# Altium project BTM74-401.PrjPcb
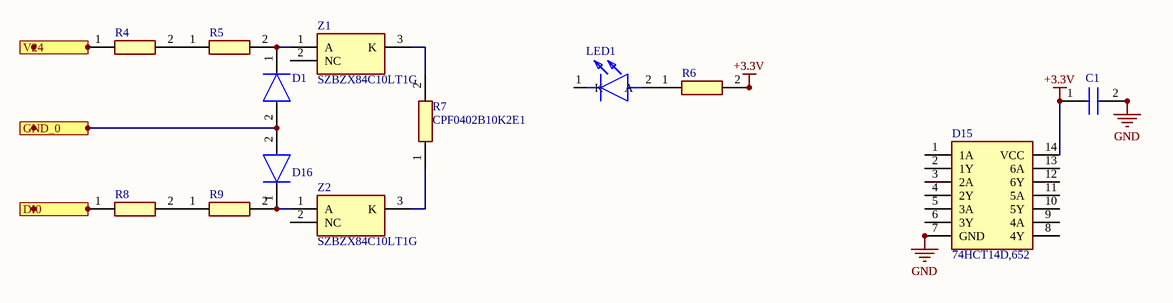
[diagram p0: Sheet1.SchDoc]
2 sheets, 60 parts. Net scope: flat (ports and power ports of the same name join across sheets).
Board file: PCB1.PcbDoc
Sheets:
  Sheet1.SchDoc
  Sheet2.SchDoc

## Sheet Sheet1.SchDoc
size 381 x 241 mm

### Parts
C1  04023C104JAT2A  [CAPC1005X56N]  (value not drawn)
D1  SMF18AT1G  [SODFL3616X98N]  (value not drawn)
D15  74HCT14D,652  [SOIC127P600X175-14N]
D16  SMF18AT1G  [SODFL3616X98N]  (value not drawn)
LED1  151034GS03000  [151034GS03000]  (value not drawn)
R4  CPF0805B330RE  [RESC2012X65N]  (value not drawn)
R5  CPF0805B330RE  [RESC2012X65N]  (value not drawn)
R6  CPF0402B300RE  [RESC1005X35N]  (value not drawn)
R7  CPF0402B10K2E1  [RESC1005X35N]
R8  CPF0805B330RE  [RESC2012X65N]  (value not drawn)
R9  CPF0805B330RE  [RESC2012X65N]  (value not drawn)
Z1  SZBZX84C10LT1G  [SOT96P237X111-3N]
Z2  SZBZX84C10LT1G  [SOT96P237X111-3N]

### Ports
DI0, GND0, GND_0, V24

### Nets
+3.3V: C1.1 D15.14(VCC) R6.2
GND: C1.2 D15.7(GND)
NetD1_1: D1.1(K) R5.2 Z1.1(A)
NetD1_2: D1.2(A) D16.2(A) ; port GND0, port GND_0
NetD16_1: D16.1(K) R9.2 Z2.1(A)
NetLED1_2: LED1.2(A) R6.1
NetR4_1: R4.1 ; port V24
NetR4_2: R4.2 R5.1
NetR7_1: R7.1 Z2.3(K)
NetR7_2: R7.2 Z1.3(K)
NetR8_1: R8.1 ; port DI0
NetR8_2: R8.2 R9.1

Not connected (* = marked no-connect by the designer): D15 1(1A) 2(1Y) 3(2A) 4(2Y) 5(3A) 6(3Y) 8(4Y) 9(4A) 10(5Y) 11(5A) 12(6Y) 13(6A); LED1 1(K); Z1 2(NC); Z2 2(NC)

### Library data of the parts
C1 = 04023C104JAT2A: Capacitor; Manufacturer_Name: AVX; Datasheet Link: http://www.mouser.com/catalog/supplier/library/pdf/AVXSurfaceMountCeramic.pdf; Height: 0.56mm; Manufacturer_Part_Number: 04023C104JAT2A; Mouser Part Number: 581-04023C104JAT2A; Mouser Price/Stock: http://www.mouser.com/Search/ProductDetail.aspx?qs=ZBeOGGPQgEHeKFST9wrKRw%3d%3d; RS Part Number: 1356696; RS Price/Stock: https://uk.rs-online.com/web/p/products/1356696
D1 D16 = SMF18AT1G: Diode; Manufacturer_Name: ON Semiconductor; Allied_Number: 70600054; Datasheet Link: http://www.onsemi.com/pub/Collateral/SMF5.0AT1-D.PDF; Height: 0.98mm; Manufacturer_Part_Number: SMF18AT1G; Allied Price/Stock: http://www.alliedelec.com/on-semiconductor-smf18at1g/70600054/
D15 = 74HCT14D,652: Integrated Circuit; Manufacturer_Name: Nexperia; Datasheet Link: https://assets.nexperia.com/documents/data-sheet/74HC_HCT14.pdf; Height: 1.75mm; Manufacturer_Part_Number: 74HCT14D,652; Mouser Part Number: 771-HCT14D652; Mouser Price/Stock: https://www.mouser.com/Search/Refine.aspx?Keyword=771-HCT14D652; RS Part Number: 1130641P; RS Price/Stock: http://uk.rs-online.com/web/p/products/1130641P
LED1 = 151034GS03000: LED; Manufacturer_Name: Wurth Elektronik; Datasheet Link: http://katalog.we-online.de/led/datasheet/151034GS03000.pdf; Manufacturer_Part_Number: 151034GS03000; RS Part Number: 9010930; RS Price/Stock: https://uk.rs-online.com/web/p/products/9010930
R4 R5 R8 R9 = CPF0805B330RE: Resistor; Manufacturer_Name: TE Connectivity; Allied_Number: 70286839; Datasheet Link: http://docs-europe.electrocomponents.com/webdocs/13d1/0900766b813d116f.pdf; Height: 0.65mm; Manufacturer_Part_Number: CPF0805B330RE; RS Part Number: 6662471; RS Price/Stock: https://uk.rs-online.com/web/p/products/6662471; Allied Price/Stock: https://www.alliedelec.com/te-connectivity-cpf0805b330re/70286839/
R6 = CPF0402B300RE: Resistor; Manufacturer_Name: TE Connectivity; Datasheet Link: http://www.farnell.com/datasheets/1786775.pdf; Height: 0.35mm; Manufacturer_Part_Number: CPF0402B300RE; RS Part Number: 6661327; RS Price/Stock: https://uk.rs-online.com/web/p/products/6661327
R7 = CPF0402B10K2E1: Resistor; Manufacturer_Name: TE Connectivity; Allied_Number: 70286155; Datasheet Link: http://www.farnell.com/datasheets/1786775.pdf; Height: 0.35mm; Manufacturer_Part_Number: CPF0402B10K2E1; Mouser Part Number: 279-CPF0402B10K2E1; Mouser Price/Stock: https://www.mouser.com/Search/Refine.aspx?Keyword=279-CPF0402B10K2E1; RS Part Number: 7015028; RS Price/Stock: https://uk.rs-online.com/web/p/products/7015028; Allied Price/Stock: https://www.alliedelec.com/te-connectivity-cpf0402b10k2e1/70286155/
Z1 Z2 = SZBZX84C10LT1G: Zener Diode; Manufacturer_Name: ON Semiconductor; Allied_Number: 70467681; Datasheet Link: http://www.onsemi.com/pub/Collateral/BZX84C2V4LT1-D.PDF; Height: 1.11mm; Manufacturer_Part_Number: SZBZX84C10LT1G; Mouser Part Number: 863-SZBZX84C10LT1G; Mouser Price/Stock: https://www.mouser.com/Search/Refine.aspx?Keyword=863-SZBZX84C10LT1G; RS Part Number: 8052914; RS Price/Stock: http://uk.rs-online.com/web/p/products/8052914; Allied Price/Stock: http://www.alliedelec.com/on-semiconductor-szbzx84c10lt1g/70467681/

## Sheet Sheet2.SchDoc
size A4
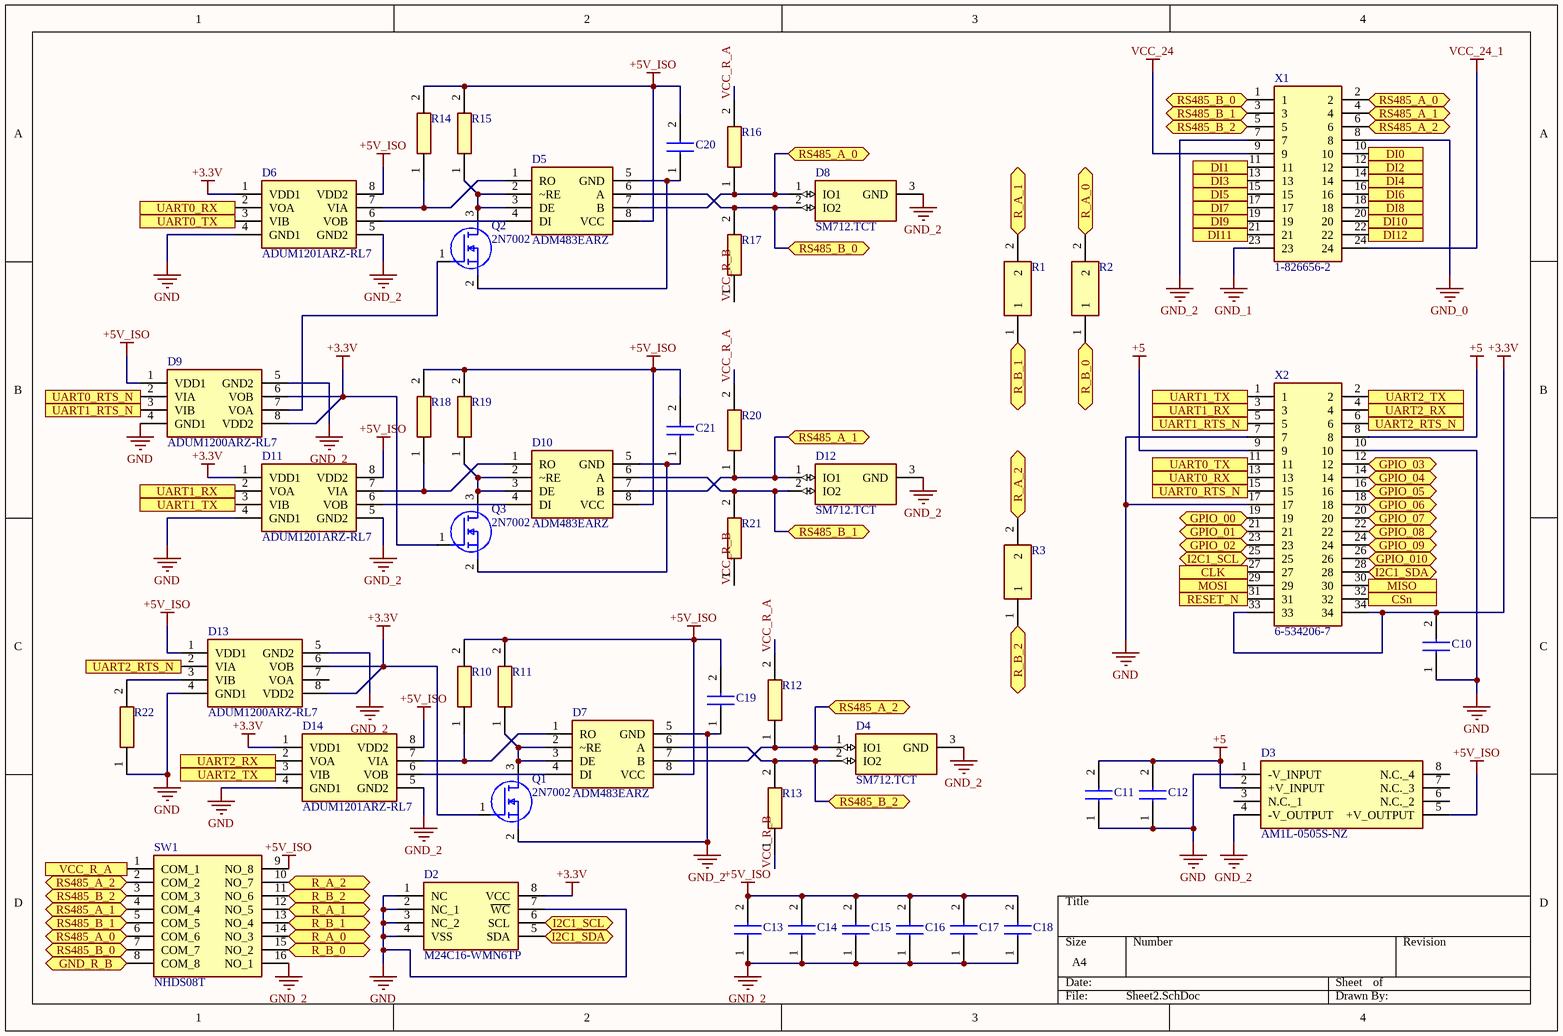
[diagram p1: Sheet2.SchDoc]

### Parts
C10  04024D106MAT2A  [CAPC1005X56N]  (value not drawn)
C11  04023C104JAT2A  [CAPC1005X56N]  (value not drawn)
C12  04024D106MAT2A  [CAPC1005X56N]  (value not drawn)
C13  04023C104JAT2A  [CAPC1005X56N]  (value not drawn)
C14  04023C104JAT2A  [CAPC1005X56N]  (value not drawn)
C15  04023C104JAT2A  [CAPC1005X56N]  (value not drawn)
C16  04023C104JAT2A  [CAPC1005X56N]  (value not drawn)
C17  04024D106MAT2A  [CAPC1005X56N]  (value not drawn)
C18  04024D106MAT2A  [CAPC1005X56N]  (value not drawn)
C19  04023C104JAT2A  [CAPC1005X56N]  (value not drawn)
C20  04023C104JAT2A  [CAPC1005X56N]  (value not drawn)
C21  04023C104JAT2A  [CAPC1005X56N]  (value not drawn)
D2  M24C16-WMN6TP  [SOIC127P600X175-8N]
D3  AM1L-0505S-NZ  [SOP254P1120X650-8N]
D4  SM712.TCT  [SOT95P237X112-3N]
D5  ADM483EARZ  [SOIC127P600X175-8N]
D6  ADUM1201ARZ-RL7  [SOIC127P600X175-8N]
D7  ADM483EARZ  [SOIC127P600X175-8N]
D8  SM712.TCT  [SOT95P237X112-3N]
D9  ADUM1200ARZ-RL7  [SOIC127P600X175-8N]
D10  ADM483EARZ  [SOIC127P600X175-8N]
D11  ADUM1201ARZ-RL7  [SOIC127P600X175-8N]
D12  SM712.TCT  [SOT95P237X112-3N]
D13  ADUM1200ARZ-RL7  [SOIC127P600X175-8N]
D14  ADUM1201ARZ-RL7  [SOIC127P600X175-8N]
Q1  2N7002  [SOT95P240X120-3N]
Q2  2N7002  [SOT95P240X120-3N]
Q3  2N7002  [SOT95P240X120-3N]
R1  BLM18AG121SN1D  [BEADC1608X95N]  (value not drawn)
R2  BLM18AG121SN1D  [BEADC1608X95N]  (value not drawn)
R3  BLM18AG121SN1D  [BEADC1608X95N]  (value not drawn)
R10  CPF0402B14K7E1  [RESC1005X35N]  (value not drawn)
R11  CPF0402B14K7E1  [RESC1005X35N]  (value not drawn)
R12  CPF0402B475RE1  [RESC1005X35N]  (value not drawn)
R13  CPF0402B475RE1  [RESC1005X35N]  (value not drawn)
R14  CPF0402B14K7E1  [RESC1005X35N]  (value not drawn)
R15  CPF0402B14K7E1  [RESC1005X35N]  (value not drawn)
R16  CPF0402B475RE1  [RESC1005X35N]  (value not drawn)
R17  CPF0402B475RE1  [RESC1005X35N]  (value not drawn)
R18  CPF0402B14K7E1  [RESC1005X35N]  (value not drawn)
R19  CPF0402B14K7E1  [RESC1005X35N]  (value not drawn)
R20  CPF0402B475RE1  [RESC1005X35N]  (value not drawn)
R21  CPF0402B475RE1  [RESC1005X35N]  (value not drawn)
R22  CPF0402B14K7E1  [RESC1005X35N]  (value not drawn)
SW1  NHDS08T  [NHDS08T]
X1  1-826656-2  [HDRV24W85P254_2X12_3048X500X900P]
X2  6-534206-7  [SHDR34W76P254_2X17_4318X503X813P]

### Ports
CLK (out), CSn (out), DI0 (in), DI1 (in), DI2 (in), DI3 (in), DI4 (in), DI5 (in), DI6 (in), DI7 (in), DI8 (in), DI9 (in), DI10 (in), DI11 (in), DI12 (in), GND_R_B (bidir), GPIO_00 (bidir), GPIO_01 (bidir), GPIO_02 (bidir), GPIO_03 (bidir), GPIO_04 (bidir), GPIO_05 (bidir), GPIO_06 (bidir), GPIO_07 (bidir), GPIO_08 (bidir), GPIO_09 (bidir), GPIO_010 (bidir), I2C1_SCL (bidir), I2C1_SDA (bidir), MISO (in), MOSI (out), R_A_0 (bidir), R_A_1 (bidir), R_A_2 (bidir), R_B_0 (bidir), R_B_1 (bidir), R_B_2 (bidir), RESET_N (in), RS485_A_0 (bidir), RS485_A_1 (bidir), RS485_A_2 (bidir), RS485_B_0 (bidir), RS485_B_1 (bidir), RS485_B_2 (bidir), UART0_RTS_N (out), UART0_RX (in), UART0_TX (out), UART1_RTS_N (out), UART1_RX (in), UART1_TX (out), UART2_RTS_N (out), UART2_RX (in), UART2_TX (out), VCC_R_A

### Nets
+3.3V: C10.2 D2.8(VCC) D6.1(VDD1) D9.6(VOB) D9.8(VDD2) D11.1(VDD1) D13.6(VOB) D13.8(VDD2) D14.1(VDD1) Q1.1(G) Q3.1(G) X2.33 X2.34
+5: C11.2 C12.2 D3.2(+V_INPUT) X2.8 X2.9
+5V_ISO: C13.2 C14.2 C15.2 C16.2 C17.2 C18.2 C19.2 C20.2 C21.2 D3.5(+V_OUTPUT) D5.8(VCC) D6.8(VDD2) D7.8(VCC) D9.1(VDD1) D10.8(VCC) D11.8(VDD2) D13.1(VDD1) D14.8(VDD2) R10.2 R11.2 R14.2 R15.2 R18.2 R19.2 SW1.9(NO_8)
GND: C10.1 C11.1 C12.1 D2.1(NC) D2.2(NC_1) D2.3(NC_2) D2.4(VSS) D2.7(~{WC}) D3.1(-V_INPUT) D6.4(GND1) D9.4(GND1) D11.4(GND1) D13.4(GND1) D14.4(GND1) R22.1 X2.7 X2.10 X2.17
GND_0: X1.8
GND_1: X1.23
GND_2: C13.1 C14.1 C15.1 C16.1 C17.1 C18.1 C19.1 D3.4(-V_OUTPUT) D4.3(GND) D6.5(GND2) D7.5(GND) D8.3(GND) D9.5(GND2) D11.5(GND2) D12.3(GND) D13.5(GND2) D14.5(GND2) Q1.2(S) SW1.16(NO_1) X1.7
VCC_24: X1.9
VCC_24_1: X1.24
VCC_R_A: R12.2 R16.2 R20.2
VCC_R_B: R13.1 R17.1 R21.1
NetC20_1: C20.1 D5.5(GND) Q2.2(S)
NetC21_1: C21.1 D10.5(GND) Q3.2(S)
NetD2_5: D2.5(SDA) X2.28 ; port I2C1_SDA
NetD2_6: D2.6(SCL) X2.25 ; port I2C1_SCL
NetD4_1: D4.1(IO1) D7.7(B) R12.1 SW1.2(COM_2) X1.6 ; port RS485_A_2
NetD4_2: D4.2(IO2) D7.6(A) R13.2 SW1.3(COM_3) X1.5 ; port RS485_B_2
NetD5_1: D5.1(RO) D6.7(VIA) R14.1
NetD5_2: D5.2(~RE) D5.3(DE) Q2.3(D) R15.1
NetD5_4: D5.4(DI) D6.6(VOB)
NetD5_6: D5.6(A) D8.2(IO2) R17.2 SW1.7(COM_7) X1.1 ; port RS485_B_0
NetD5_7: D5.7(B) D8.1(IO1) R16.1 SW1.6(COM_6) X1.2 ; port RS485_A_0
NetD6_2: D6.2(VOA) X2.13 ; port UART0_RX
NetD6_3: D6.3(VIB) X2.11 ; port UART0_TX
NetD7_1: D7.1(RO) D14.7(VIA) R10.1
NetD7_2: D7.2(~RE) D7.3(DE) Q1.3(D) R11.1
NetD7_4: D7.4(DI) D14.6(VOB)
NetD9_2: D9.2(VIA) X2.15 ; port UART0_RTS_N
NetD9_3: D9.3(VIB) X2.5 ; port UART1_RTS_N
NetD9_7: D9.7(VOA) Q2.1(G)
NetD10_1: D10.1(RO) D11.7(VIA) R18.1
NetD10_2: D10.2(~RE) D10.3(DE) Q3.3(D) R19.1
NetD10_4: D10.4(DI) D11.6(VOB)
NetD10_6: D10.6(A) D12.2(IO2) R21.2 SW1.5(COM_5) X1.3 ; port RS485_B_1
NetD10_7: D10.7(B) D12.1(IO1) R20.1 SW1.4(COM_4) X1.4 ; port RS485_A_1
NetD11_2: D11.2(VOA) X2.3 ; port UART1_RX
NetD11_3: D11.3(VIB) X2.1 ; port UART1_TX
NetD13_2: D13.2(VIA) X2.6 ; port UART2_RTS_N
NetD13_3: D13.3(VIB) R22.2
NetD14_2: D14.2(VOA) X2.4 ; port UART2_RX
NetD14_3: D14.3(VIB) X2.2 ; port UART2_TX
NetR1_1: R1.1 SW1.13(NO_4) ; port R_B_1
NetR1_2: R1.2 SW1.12(NO_5) ; port R_A_1
NetR2_1: R2.1 SW1.15(NO_2) ; port R_B_0
NetR2_2: R2.2 SW1.14(NO_3) ; port R_A_0
NetR3_1: R3.1 SW1.11(NO_6) ; port R_B_2
NetR3_2: R3.2 SW1.10(NO_7) ; port R_A_2
NetR8_1: X1.10 ; port DI0
NetSW1_1: SW1.1(COM_1) ; port VCC_R_A
NetSW1_8: SW1.8(COM_8) ; port GND_R_B
NetX1_11: X1.11 ; port DI1
NetX1_12: X1.12 ; port DI2
NetX1_13: X1.13 ; port DI3
NetX1_14: X1.14 ; port DI4
NetX1_15: X1.15 ; port DI5
NetX1_16: X1.16 ; port DI6
NetX1_17: X1.17 ; port DI7
NetX1_18: X1.18 ; port DI8
NetX1_19: X1.19 ; port DI9
NetX1_20: X1.20 ; port DI10
NetX1_21: X1.21 ; port DI11
NetX1_22: X1.22 ; port DI12
NetX2_12: X2.12 ; port GPIO_03
NetX2_14: X2.14 ; port GPIO_04
NetX2_16: X2.16 ; port GPIO_05
NetX2_18: X2.18 ; port GPIO_06
NetX2_19: X2.19 ; port GPIO_00
NetX2_20: X2.20 ; port GPIO_07
NetX2_21: X2.21 ; port GPIO_01
NetX2_22: X2.22 ; port GPIO_08
NetX2_23: X2.23 ; port GPIO_02
NetX2_24: X2.24 ; port GPIO_09
NetX2_26: X2.26 ; port GPIO_010
NetX2_27: X2.27 ; port CLK
NetX2_29: X2.29 ; port MOSI
NetX2_30: X2.30 ; port MISO
NetX2_31: X2.31 ; port RESET_N
NetX2_32: X2.32 ; port CSn

Not connected (* = marked no-connect by the designer): D3 3(N.C._1) 6(N.C._2) 7(N.C._3) 8(N.C._4); D13 7(VOA)

### Library data of the parts
C10 C12 C17 C18 = 04024D106MAT2A: Capacitor; Manufacturer_Name: AVX; Datasheet Link: http://www.mouser.com/catalog/supplier/library/pdf/AVXSurfaceMountCeramic.pdf; Height: 0.56mm; Manufacturer_Part_Number: 04024D106MAT2A; Mouser Part Number: 581-04024D106MAT2A; Mouser Price/Stock: https://www.mouser.com/Search/Refine.aspx?Keyword=581-04024D106MAT2A
C11 C13-C16 C19-C21 = 04023C104JAT2A: Capacitor; Manufacturer_Name: AVX; Datasheet Link: http://www.mouser.com/catalog/supplier/library/pdf/AVXSurfaceMountCeramic.pdf; Height: 0.56mm; Manufacturer_Part_Number: 04023C104JAT2A; Mouser Part Number: 581-04023C104JAT2A; Mouser Price/Stock: http://www.mouser.com/Search/ProductDetail.aspx?qs=ZBeOGGPQgEHeKFST9wrKRw%3d%3d; RS Part Number: 1356696; RS Price/Stock: https://uk.rs-online.com/web/p/products/1356696
D2 = M24C16-WMN6TP: Integrated Circuit; Manufacturer_Name: STMicroelectronics; Allied_Number: 70013715; Datasheet Link: http://www.st.com/st-web-ui/static/active/en/resource/technical/document/datasheet/DM00061111.pdf; Height: 1.75mm; Manufacturer_Part_Number: M24C16-WMN6TP; Mouser Part Number: 511-M24C16-WMN6TP; Mouser Price/Stock: https://www.mouser.com/Search/Refine.aspx?Keyword=511-M24C16-WMN6TP; RS Part Number: 6862390; RS Price/Stock: https://uk.rs-online.com/web/p/products/6862390; Allied Price/Stock: http://www.alliedelec.com/stmicroelectronics-m24c16-wmn6tp/70013715/
D3 = AM1L-0505S-NZ: Power Supply; Manufacturer_Name: aimtec; Datasheet Link: http://www.aimtec.com/site/Aimtec/files/Datasheet/HighResolution/AM1L-N-Z.pdf; Height: 6.5mm; Manufacturer_Part_Number: AM1L-0505S-NZ
D4 D8 D12 = SM712.TCT: Diode; Manufacturer_Name: SEMTECH; Datasheet Link: http://docs-emea.rs-online.com/webdocs/1385/0900766b81385d5f.pdf; Height: 1.12mm; Manufacturer_Part_Number: SM712.TCT; Mouser Part Number: 947-SM712.TCT; Mouser Price/Stock: https://www.mouser.com/Search/Refine.aspx?Keyword=947-SM712.TCT; RS Part Number: 6783470P; RS Price/Stock: http://uk.rs-online.com/web/p/products/6783470P
D5 D7 D10 = ADM483EARZ: Integrated Circuit; Manufacturer_Name: Analog Devices; Manufacturer_Part_Number: ADM483EARZ; Mouser Part Number: 584-ADM483EARZ; Mouser Price/Stock: https://www.mouser.com/Search/Refine.aspx?Keyword=584-ADM483EARZ; RS Part Number: 2509605926; RS Price/Stock: http://uk.rs-online.com/web/p/products/2509605926
D6 D11 D14 = ADUM1201ARZ-RL7: Integrated Circuit; Manufacturer_Name: Analog Devices; Datasheet Link: http://www.analog.com/media/en/technical-documentation/data-sheets/ADuM1200_1201.pdf; Height: 1.75mm; Manufacturer_Part_Number: ADUM1201ARZ-RL7; Mouser Part Number: 584-ADUM1201ARZ-R7; Mouser Price/Stock: https://www.mouser.com/Search/Refine.aspx?Keyword=584-ADUM1201ARZ-R7; RS Part Number: 1832299; RS Price/Stock: http://uk.rs-online.com/web/p/products/1832299
D9 D13 = ADUM1200ARZ-RL7: Integrated Circuit; Manufacturer_Name: Analog Devices; Datasheet Link: http://componentsearchengine.com/Datasheets/1/ADUM1200ARZ-RL7.pdf; Manufacturer_Part_Number: ADUM1200ARZ-RL7; Mouser Part Number: 584-ADUM1200ARZ-R7; Mouser Price/Stock: https://www.mouser.com/Search/Refine.aspx?Keyword=584-ADUM1200ARZ-R7; RS Part Number: 9140444; RS Price/Stock: http://uk.rs-online.com/web/p/products/9140444
Q1-Q3 = 2N7002: MOSFET (N-Channel); Manufacturer_Name: Fairchild Semiconductor; Datasheet Link: http://www.onsemi.com/pub/Collateral/NDS7002A-D.PDF; Height: 1.2mm; Manufacturer_Part_Number: 2N7002; Mouser Part Number: 512-2N7002; Mouser Price/Stock: https://www.mouser.com/Search/Refine.aspx?Keyword=512-2N7002
R1-R3 = BLM18AG121SN1D: Ferrite Bead; Manufacturer_Name: Murata Electronics; Datasheet Link: http://www.murata.com/~/media/webrenewal/support/library/catalog/products/emc/emifil/c31e.ashx?la=en-gb; Height: 0.95mm; Manufacturer_Part_Number: BLM18AG121SN1D; Mouser Part Number: 81-BLM11A121S; Mouser Price/Stock: https://www.mouser.com/Search/Refine.aspx?Keyword=81-BLM11A121S; RS Part Number: 6291628; RS Price/Stock: http://uk.rs-online.com/web/p/products/6291628
R10 R11 R14 R15 R18 R19 R22 = CPF0402B14K7E1: Resistor; Manufacturer_Name: TE Connectivity; Allied_Number: 70286210; Datasheet Link: http://www.farnell.com/datasheets/1786775.pdf; Height: 0.35mm; Manufacturer_Part_Number: CPF0402B14K7E1; Mouser Part Number: 279-CPF0402B14K7E1; Mouser Price/Stock: https://www.mouser.com/Search/Refine.aspx?Keyword=279-CPF0402B14K7E1; RS Part Number: 7015122; RS Price/Stock: https://uk.rs-online.com/web/p/products/7015122; Allied Price/Stock: https://www.alliedelec.com/te-connectivity-cpf0402b14k7e1/70286210/
R12 R13 R16 R17 R20 R21 = CPF0402B475RE1: Resistor; Manufacturer_Name: TE Connectivity; Allied_Number: 70286471; Datasheet Link: http://www.farnell.com/datasheets/1786775.pdf; Height: 0.35mm; Manufacturer_Part_Number: CPF0402B475RE1; RS Part Number: 7014807; RS Price/Stock: https://uk.rs-online.com/web/p/products/7014807; Allied Price/Stock: https://www.alliedelec.com/te-connectivity-cpf0402b475re1/70286471/
SW1 = NHDS08T: Switch; Manufacturer_Name: Apem; Datasheet Link: https://componentsearchengine.com/Datasheets/1/NHDS08T.pdf; Height: 1.45mm; Manufacturer_Part_Number: NHDS08T; Mouser Part Number: 642-NHDS08T; Mouser Price/Stock: https://www.mouser.com/Search/Refine.aspx?Keyword=642-NHDS08T
X1 = 1-826656-2: Connector; Manufacturer_Name: TE Connectivity; Allied_Number: 70299217; Datasheet Link: http://www.te.com/usa-en/product-1-826656-2.html; Height: 9mm; Manufacturer_Part_Number: 1-826656-2; Mouser Part Number: 571-1-826656-2; Mouser Price/Stock: https://www.mouser.com/Search/Refine.aspx?Keyword=571-1-826656-2; RS Part Number: 6689624P; RS Price/Stock: http://uk.rs-online.com/web/p/products/6689624P; Allied Price/Stock: https://www.alliedelec.com/te-connectivity-1-826656-2/70299217/
X2 = 6-534206-7: Connector; Manufacturer_Name: TE Connectivity; Datasheet Link: https://benl.rs-online.com/web/p/products/7936824P; Height: 8.13mm; Manufacturer_Part_Number: 6-534206-7; Mouser Part Number: 571-6-534206-7; Mouser Price/Stock: https://www.mouser.com/Search/Refine.aspx?Keyword=571-6-534206-7; RS Part Number: 7936824; RS Price/Stock: https://uk.rs-online.com/web/p/products/7936824

## Nets that join several sheets
+3.3V: Sheet1 (C1.1 D15.14 R6.2), Sheet2 (13 pins)
GND: Sheet1 (C1.2 D15.7), Sheet2 (18 pins)
NetR8_1: Sheet1 (R8.1), Sheet2 (X1.10)